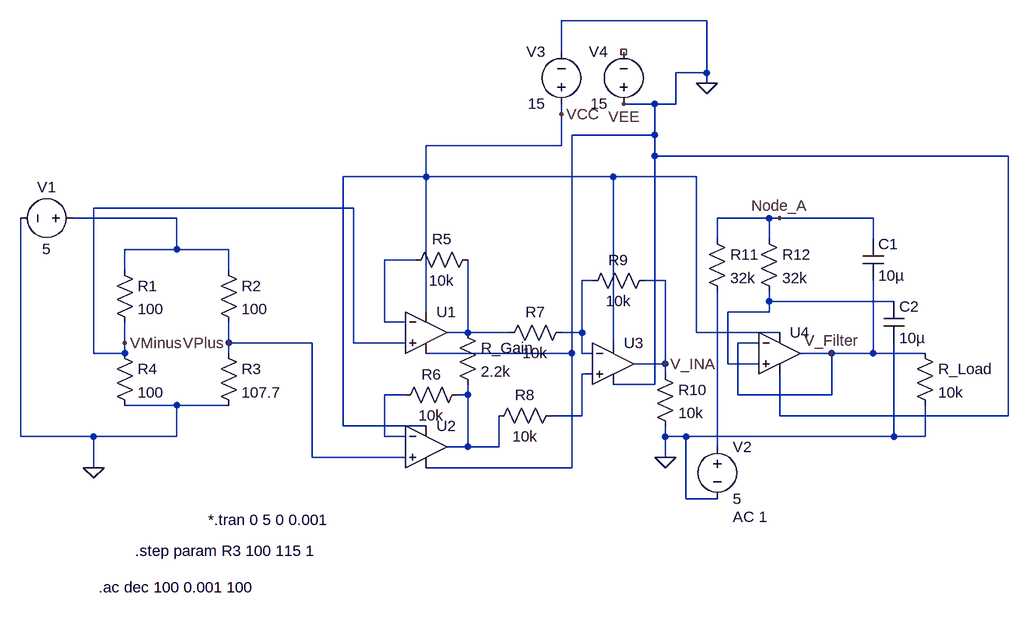
[diagram p0: schematic EE252-File2-TempChannel.asc]
EE252-File2-TempChannel.asc, the LTspice schematic file:
Version 4.1
SHEET 1 1316 680
WIRE 848 -624 624 -624
WIRE 624 -576 624 -624
WIRE 848 -544 848 -624
WIRE 848 -544 800 -544
WIRE 848 -528 848 -544
WIRE 768 -496 720 -496
WIRE 800 -496 800 -544
WIRE 800 -496 768 -496
WIRE 624 -480 624 -496
WIRE 768 -448 768 -496
WIRE 768 -448 640 -448
WIRE 624 -432 624 -480
WIRE 624 -432 416 -432
WIRE 768 -416 768 -448
WIRE 1312 -416 768 -416
WIRE 416 -384 416 -432
WIRE 416 -384 288 -384
WIRE 704 -384 416 -384
WIRE 832 -384 704 -384
WIRE 304 -336 -96 -336
WIRE 32 -320 -128 -320
WIRE 944 -320 864 -320
WIRE 960 -320 944 -320
WIRE 1104 -320 960 -320
WIRE 864 -288 864 -320
WIRE 944 -288 944 -320
WIRE 1104 -288 1104 -320
WIRE 32 -272 32 -320
WIRE 32 -272 -48 -272
WIRE 112 -272 32 -272
WIRE 400 -256 352 -256
WIRE -48 -240 -48 -272
WIRE 112 -240 112 -272
WIRE 672 -224 656 -224
WIRE 784 -224 752 -224
WIRE 944 -192 944 -208
WIRE 1136 -192 944 -192
WIRE 416 -176 416 -384
WIRE 944 -176 944 -192
WIRE 944 -176 880 -176
WIRE 352 -160 352 -256
WIRE 384 -160 352 -160
WIRE 480 -144 480 -256
WIRE 480 -144 448 -144
WIRE 544 -144 480 -144
WIRE 656 -144 656 -224
WIRE 656 -144 624 -144
WIRE 832 -144 832 -384
WIRE 960 -144 832 -144
WIRE -48 -128 -48 -160
WIRE 112 -128 112 -160
WIRE 240 -128 112 -128
WIRE 304 -128 304 -336
WIRE 384 -128 304 -128
WIRE 704 -128 704 -384
WIRE 928 -128 896 -128
WIRE -96 -112 -96 -336
WIRE -48 -112 -48 -128
WIRE -48 -112 -96 -112
WIRE 112 -112 112 -128
WIRE 640 -112 640 -448
WIRE 640 -112 416 -112
WIRE 656 -112 656 -144
WIRE 672 -112 656 -112
WIRE 1040 -112 992 -112
WIRE 1104 -112 1104 -224
WIRE 1104 -112 1040 -112
WIRE 1184 -112 1104 -112
WIRE 784 -96 784 -224
WIRE 784 -96 736 -96
WIRE 880 -96 880 -176
WIRE 928 -96 880 -96
WIRE 672 -80 656 -80
WIRE 784 -80 784 -96
WIRE 768 -64 768 -416
WIRE 768 -64 704 -64
WIRE 384 -48 352 -48
WIRE 480 -48 480 -64
WIRE 480 -48 464 -48
WIRE 896 -48 896 -128
WIRE 1040 -48 1040 -112
WIRE 1040 -48 896 -48
WIRE 32 -32 -48 -32
WIRE 112 -32 32 -32
WIRE 656 -16 656 -80
WIRE 656 -16 608 -16
WIRE 960 -16 960 -80
WIRE 1312 -16 1312 -416
WIRE 1312 -16 960 -16
WIRE 288 0 288 -384
WIRE 416 0 288 0
WIRE -208 16 -208 -320
WIRE -96 16 -208 16
WIRE 32 16 32 -32
WIRE 32 16 -96 16
WIRE 352 16 352 -48
WIRE 384 16 352 16
WIRE 784 16 784 0
WIRE 816 16 784 16
WIRE 1136 16 1136 -128
WIRE 1136 16 816 16
WIRE 1184 16 1184 -32
WIRE 1184 16 1136 16
WIRE 480 32 480 -48
WIRE 480 32 448 32
WIRE 528 32 528 -16
WIRE 528 32 480 32
WIRE 864 32 864 -208
WIRE 240 48 240 -128
WIRE 384 48 240 48
WIRE 784 48 784 16
WIRE -96 64 -96 16
WIRE 640 64 640 -112
WIRE 640 64 416 64
WIRE 816 112 816 16
WIRE 864 112 816 112
FLAG -96 64 0
FLAG -48 -128 VMinus
FLAG 112 -128 VPlus
FLAG 784 48 0
FLAG 960 -320 Node_A
FLAG 1040 -112 V_Filter
FLAG 848 -528 0
FLAG 720 -496 VEE
FLAG 624 -480 VCC
FLAG 784 -96 V_INA
SYMBOL voltage -112 -320 R90
WINDOW 0 -32 56 VBottom 2
WINDOW 3 32 56 VTop 2
WINDOW 123 -4 56 VBottom 2
WINDOW 39 0 0 Left 0
SYMATTR InstName V1
SYMATTR Value 5
SYMBOL res -64 -256 R0
SYMATTR InstName R1
SYMATTR Value 100
SYMBOL res 96 -128 R0
SYMATTR InstName R3
SYMATTR Value 107.7
SYMBOL res -64 -128 R0
SYMATTR InstName R4
SYMATTR Value 100
SYMBOL res 96 -256 R0
SYMATTR InstName R2
SYMATTR Value 100
SYMBOL OpAmps\\UniversalOpAmp2 416 -144 R0
SYMATTR InstName U1
SYMATTR Value2 Avol=1Meg GBW=1Meg Slew=10Meg
SYMATTR SpiceLine2 En=0 Enk=0 In=0 Ink=0 Rin=1T
SYMBOL res 464 -160 R0
SYMATTR InstName R_Gain
SYMATTR Value 2.2k
SYMBOL res 496 -272 R90
WINDOW 0 0 56 VBottom 2
WINDOW 3 32 56 VTop 2
SYMATTR InstName R5
SYMATTR Value 10k
SYMBOL OpAmps\\UniversalOpAmp2 416 32 R0
SYMATTR InstName U2
SYMATTR Value2 Avol=1Meg GBW=1Meg Slew=10Meg
SYMATTR SpiceLine2 En=0 Enk=0 In=0 Ink=0 Rin=1T
SYMBOL res 480 -64 R90
WINDOW 0 0 56 VBottom 2
WINDOW 3 32 56 VTop 2
SYMATTR InstName R6
SYMATTR Value 10k
SYMBOL OpAmps\\UniversalOpAmp2 704 -96 R0
SYMATTR InstName U3
SYMATTR Value2 Avol=1Meg GBW=1Meg Slew=10Meg
SYMATTR SpiceLine2 En=0 Enk=0 In=0 Ink=0 Rin=1T
SYMBOL res 640 -160 R90
WINDOW 0 0 56 VBottom 2
WINDOW 3 32 56 VTop 2
SYMATTR InstName R7
SYMATTR Value 10k
SYMBOL res 624 -32 R90
WINDOW 0 0 56 VBottom 2
WINDOW 3 32 56 VTop 2
SYMATTR InstName R8
SYMATTR Value 10k
SYMBOL res 768 -240 R90
WINDOW 0 0 56 VBottom 2
WINDOW 3 32 56 VTop 2
SYMATTR InstName R9
SYMATTR Value 10k
SYMBOL res 768 -96 R0
SYMATTR InstName R10
SYMATTR Value 10k
SYMBOL OpAmps\\UniversalOpAmp2 960 -112 R0
SYMATTR InstName U4
SYMATTR Value2 Avol=1Meg GBW=1Meg Slew=10Meg
SYMATTR SpiceLine2 En=0 Enk=0 In=0 Ink=0 Rin=1T
SYMBOL res 848 -304 R0
SYMATTR InstName R11
SYMATTR Value 32k
SYMBOL res 928 -304 R0
SYMATTR InstName R12
SYMATTR Value 32k
SYMBOL cap 1088 -288 R0
SYMATTR InstName C1
SYMATTR Value 10µ
SYMBOL res 1168 -128 R0
SYMATTR InstName R_Load
SYMATTR Value 10k
SYMBOL cap 1120 -192 R0
SYMATTR InstName C2
SYMATTR Value 10µ
SYMBOL voltage 624 -480 R180
WINDOW 0 24 96 Left 2
WINDOW 3 24 16 Left 2
WINDOW 123 0 0 Left 0
WINDOW 39 0 0 Left 0
SYMATTR InstName V3
SYMATTR Value 15
SYMBOL voltage 720 -480 R180
WINDOW 0 24 96 Left 2
WINDOW 3 24 16 Left 2
WINDOW 123 0 0 Left 0
WINDOW 39 0 0 Left 0
SYMATTR InstName V4
SYMATTR Value 15
SYMBOL voltage 864 16 R0
WINDOW 123 24 124 Left 2
WINDOW 39 0 0 Left 0
SYMATTR Value2 AC 1
SYMATTR InstName V2
SYMATTR Value 5
TEXT -88 248 Left 2 !.ac dec 100 0.001 100
TEXT 80 144 Left 2 !*.tran 0 5 0 0.001
TEXT -32 192 Left 2 !.step param R3 100 115 1

The netlist it stands for:
* EE252-File2-TempChannel.asc
V1 N001 0 5
R1 N001 VMinus 100
R3 VPlus 0 107.7
R4 VMinus 0 100
R2 N001 VPlus 100
X§U1 VMinus N002 VCC 0 N005 level2 Avol=1Meg GBW=1Meg Slew=10Meg Ilimit=25m Rail=0 Vos=0 En=0 Enk=0 In=0 Ink=0 Rin=1T  ; pins In+ In- V+ V- OUT
R_Gain N005 N008 2.2k
R5 N005 N002 10k
X§U2 VPlus N007 VCC 0 N008 level2 Avol=1Meg GBW=1Meg Slew=10Meg Ilimit=25m Rail=0 Vos=0 En=0 Enk=0 In=0 Ink=0 Rin=1T  ; pins In+ In- V+ V- OUT
R6 N008 N007 10k
X§U3 N006 N003 VCC 0 V_INA level2 Avol=1Meg GBW=1Meg Slew=10Meg Ilimit=25m Rail=0 Vos=0 En=0 Enk=0 In=0 Ink=0 Rin=1T  ; pins In+ In- V+ V- OUT
R7 N003 N005 10k
R8 N006 N008 10k
R9 V_INA N003 10k
R10 V_INA 0 10k
X§U4 N004 V_Filter VCC 0 V_Filter level2 Avol=1Meg GBW=1Meg Slew=10Meg Ilimit=25m Rail=0 Vos=0 En=0 Enk=0 In=0 Ink=0 Rin=1T  ; pins In+ In- V+ V- OUT
R11 Node_A N009 32k
R12 Node_A N004 32k
C1 Node_A V_Filter 10µ
R_Load V_Filter 0 10k
C2 N004 0 10µ
V3 VCC 0 15
V4 0 NC_01 15
V2 N009 0 5 AC 1
.ac dec 100 0.001 100
*.tran 0 5 0 0.001
.step param R3 100 115 1
.lib UniversalOpAmp2.lib
.backanno
.end